# EAGLE schematic proto (EAGLE 6.5.0)
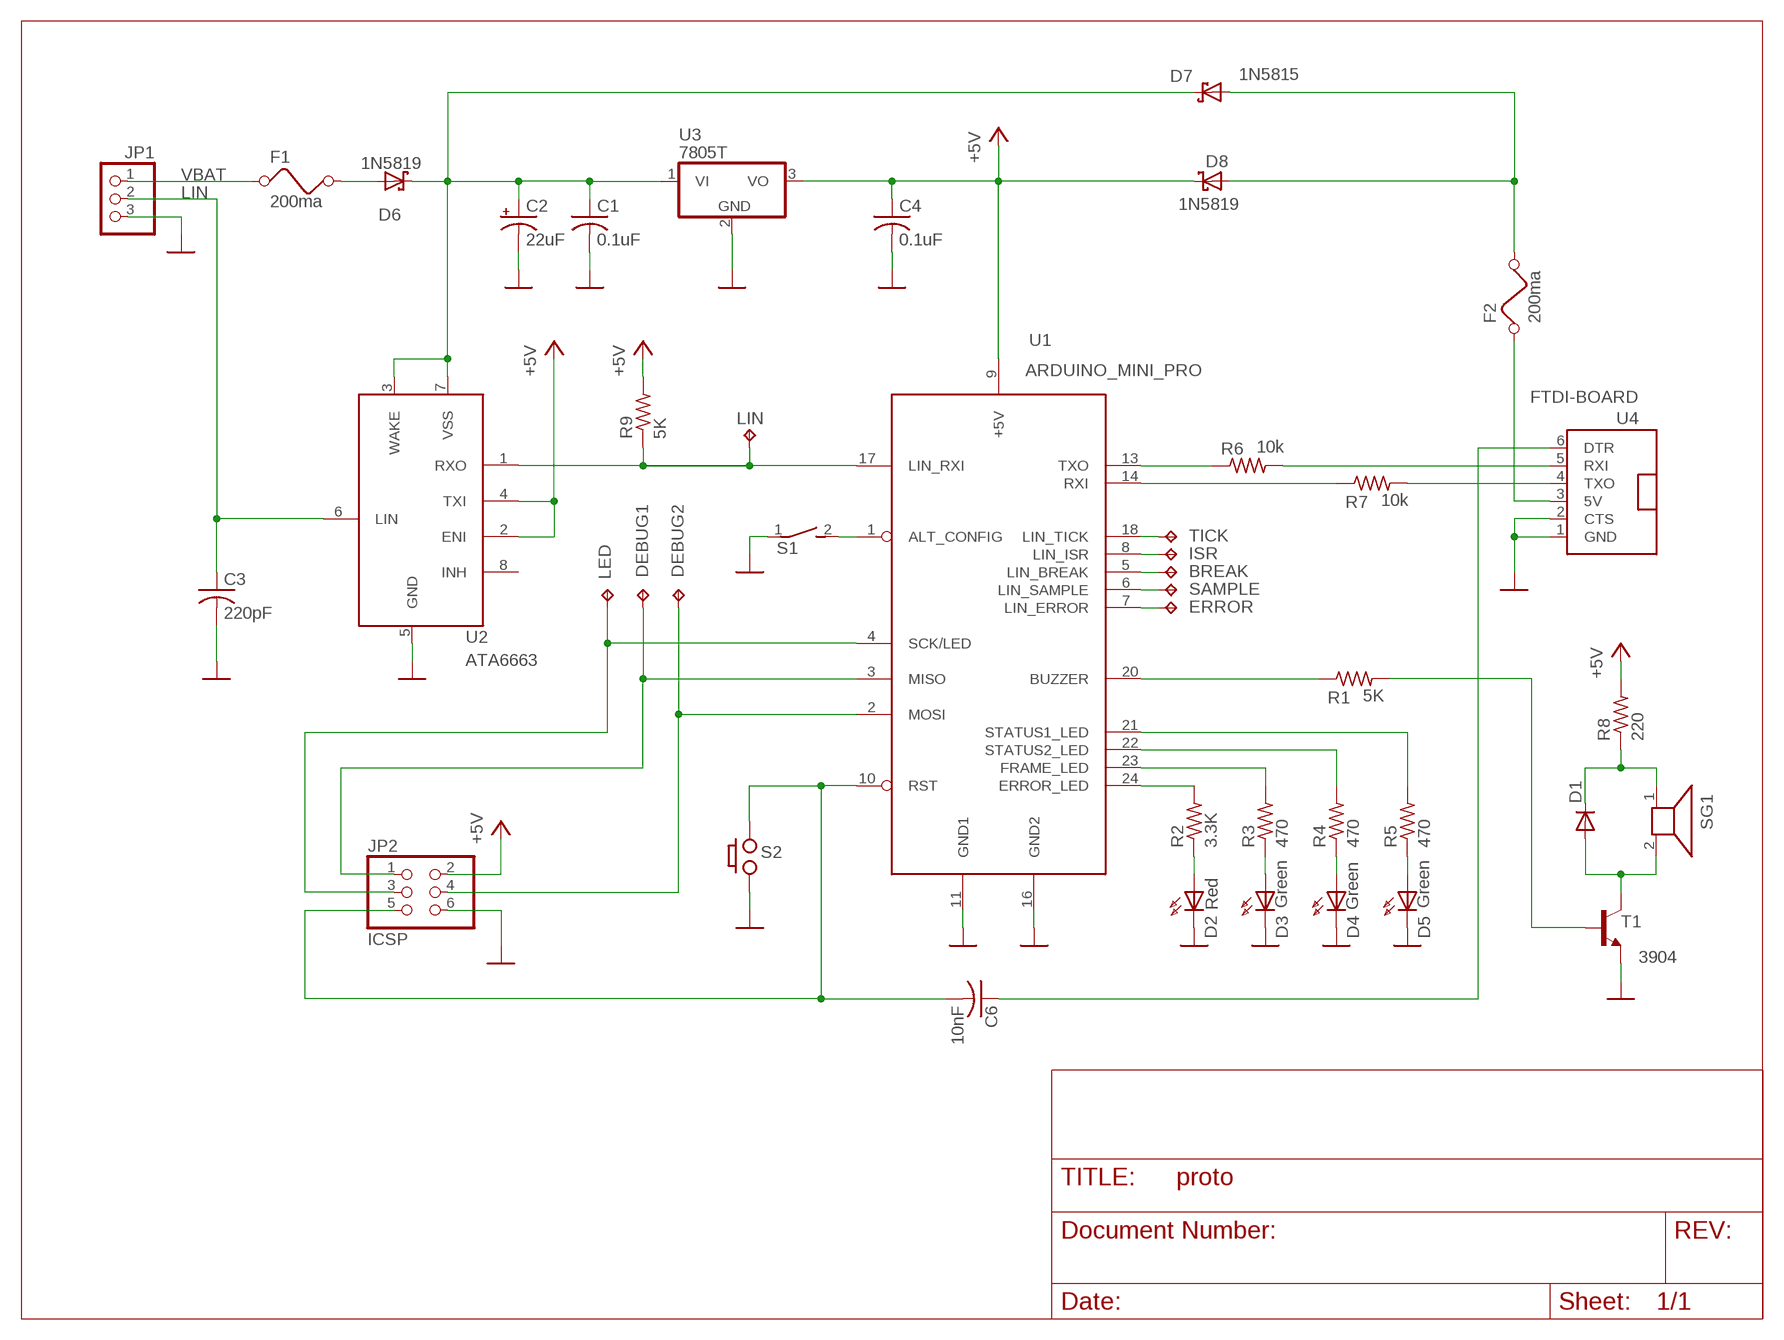
[diagram p0: schematic, sheet 1]

## Parts
BREAK  TPPAD1-17  [P1-17]
C1  0.1uF  C-USC0805  [C0805]
C2  22uF  CPOL-USSMCC  [SMC_C]
C3  220pF  C-USC0805  [C0805]
C4  0.1uF  C-USC0805  [C0805]
C6  10nF  C-USC0805  [C0805]
D1  DIODE-MINIMELF  [MINIMELF]
D2  Red  HLMP6  [HLMP6]
D3  Green  HLMP6  [HLMP6]
D4  Green  HLMP6  [HLMP6]
D5  Green  HLMP6  [HLMP6]
D6  1N5819  MBRS320T3  [SMC]
D7  1N5815  MBRS320T3  [SMC]
D8  1N5819  MBRS320T3  [SMC]
DEBUG1  TPPAD1-17  [P1-17]
DEBUG2  TPPAD1-17  [P1-17]
ERROR  TPPAD1-17  [P1-17]
F1  200ma  FUSE  [FUSE]
F2  200ma  FUSE  [FUSE]
ISR  TPPAD1-17  [P1-17]
JP1  PINHD-1X3  [1X03]
JP2  ICSP  PINHD-2X3  [2X03]
LED  TPPAD1-17  [P1-17]
LIN  TPPAD1-17  [P1-17]
R1  5K  R-US_R0805  [R0805]
R2  3.3K  R-US_R0805  [R0805]
R3  470  R-US_R0805  [R0805]
R4  470  R-US_R0805  [R0805]
R5  470  R-US_R0805  [R0805]
R6  10k  R-US_R0805  [R0805]
R7  10k  R-US_R0805  [R0805]
R8  220  R-US_R0805  [R0805]
R9  5K  R-US_R0805  [R0805]
S1  DS01E  [DS-01]
S2  PUSH_BUTTON  [DUMMY-2]
SAMPLE  TPPAD1-17  [P1-17]
SG1  F/SMX  [F/SMX]
T1  3904  MMBT3904LT1-NPN-SOT23-BEC  [SOT23-BEC]
TICK  TPPAD1-17  [P1-17]
U1  ARDUINO_MINI_PRO  ARDUINO_MINI_PRODIP24-6  [ARDUINO-PRO-MINI]
U2  ATA6663  [SO-08]
U3  7805T  [TO220H]
U4  FTDI-BOARD  FTDI-OBARD  [FTDI-BOARD]

## Nets
+5V: C4.1 D8.C JP2.2 R8.2 R9.2 U1.9(+5V) U2.2(ENI) U2.4(TXI) U3.3(VO)
+12V: C1.1 C2.+ D6.C D7.C U2.3(WAKE) U2.7(VSS) U3.1(VI)
GND: C1.2 C2.- C3.2 C4.2 D2.K D3.K D4.K D5.K JP1.3 JP2.6 S1.1 S2.P$2 T1.E U1.11(GND1) U1.16(GND2) U2.5(GND) U3.2(GND) U4.1(GND) U4.2(CTS)
LIN: C3.1 JP1.2 U2.6(LIN)
N$1: D5.A R5.1
N$2: D4.A R4.1
N$3: D3.A R3.1
N$4: D2.A R2.1
N$5: BREAK.TP U1.5(LIN_BREAK)
N$6: SAMPLE.TP U1.6(LIN_SAMPLE)
N$7: R2.2 U1.24(ERROR_LED)
N$8: R3.2 U1.23(FRAME_LED)
N$9: R4.2 U1.22(STATUS2_LED)
N$10: R5.2 U1.21(STATUS1_LED)
N$11: ERROR.TP U1.7(LIN_ERROR)
N$12: D7.A D8.A F2.2
N$13: C6.1 U4.6(DTR)
N$14: R7.1 U1.14(RXI)
N$15: C6.2 JP2.5 S2.P$1 U1.10(RST)
N$16: F2.1 U4.3(5V)
N$17: R1.1 U1.20(BUZZER)
N$18: LIN.TP R9.1 U1.17(LIN_RXI) U2.1(RXO)
N$19: R1.2 T1.B
N$20: DEBUG2.TP JP2.4 U1.2(MOSI)
N$21: R7.2 U4.4(TXO)
N$22: R6.1 U1.13(TXO)
N$23: R6.2 U4.5(RXI)
N$24: D6.A F1.2
N$25: DEBUG1.TP JP2.1 U1.3(MISO)
N$26: TICK.TP U1.18(LIN_TICK)
N$27: S1.2 U1.1(ALT_CONFIG)
N$28: JP2.3 LED.TP U1.4(SCK/LED)
N$29: ISR.TP U1.8(LIN_ISR)
N$30: D1.C R8.1 SG1.1
N$31: D1.A SG1.2 T1.C
VBAT: F1.1 JP1.1
Unconnected: U2.8(INH)

## Library data of the parts
BREAK DEBUG1 DEBUG2 ERROR ISR LED LIN SAMPLE TICK = testpad:TP: Test pad
C1 C3 C4 C6 = rcl:C-US: CAPACITOR, American symbol
C2 = rcl:CPOL-US: POLARIZED CAPACITOR, American symbol
D1 = diode:DIODE-: DIODE
D2-D5 = display-hp:HLMP6: LED 2mm horizontal; MF: AGILENT TECHNOLOGIES; MPN: HLMP-6500; OC_FARNELL: 1652490; OC_NEWARK: 40K0088
D6-D8 = diode:MBRS3*0T3: SCHOTTKY BARRIER RECTIFIER 3.0 AMPERES 20, 30, 40 VOLT Source: MBRS340T3-D.pdf
F1 F2 = special:FUSE: FUSE 5 x 20 mm
JP1 = pinhead:PINHD-1X3: PIN HEADER
JP2 = pinhead:PINHD-2X3: PIN HEADER
R1-R9 = rcl:R-US_: RESISTOR, American symbol
S1 = switch-dil:DS01E: DIL/CODE SWITCH; OC_FARNELL: unknown; OC_NEWARK: unknown
S2 = my_lib:PUSH_BUTTON
SG1 = buzzer:F/SMX: BUZZER Source: Buerklin; OC_FARNELL: unknown; OC_NEWARK: unknown
T1 = transistor:*-NPN-: NPN Transistror BF959 corrected 2008.03.06
U1 = my_lib:ARDUINO_MINI_PRO
U2 = my_lib:ATA6663
U3 = linear:78*: Positive VOLTAGE REGULATOR Source: http://cache.national.com/ds/LM/LM78L05.pdf http://www.fairchildsemi.com/ds/LM/LM7805.pdf
U4 = my_lib:FTDI-OBARD